# Altium schematic sheet Sheet2.SchDoc
size A4
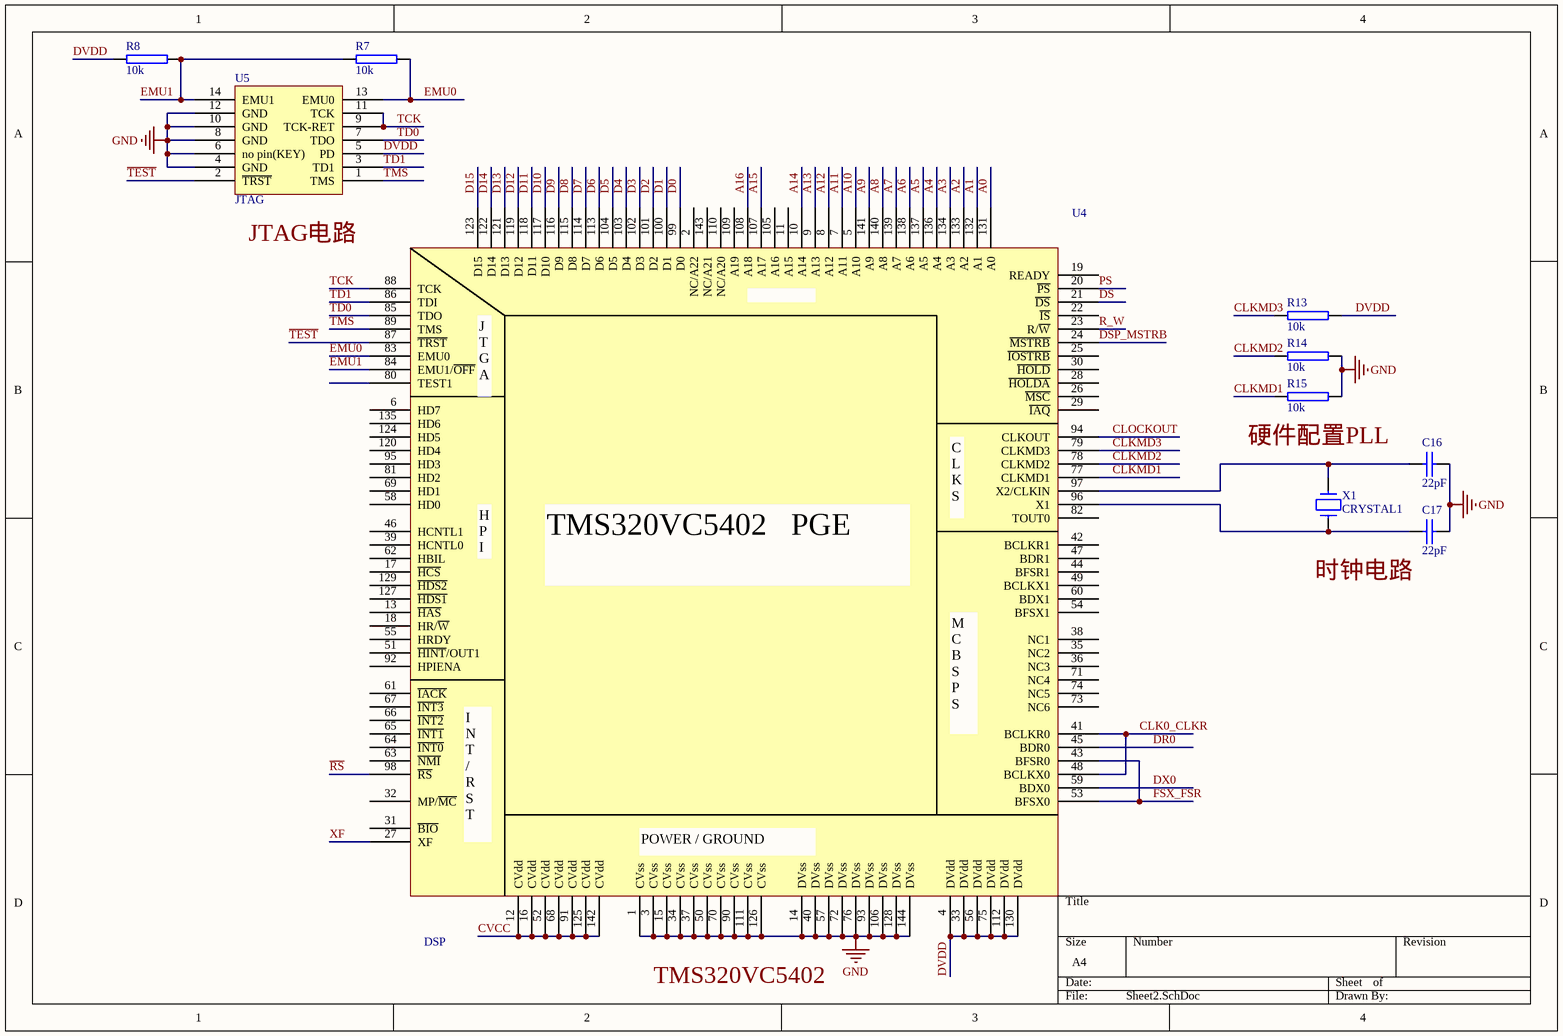
[diagram p0: Sheet2.SchDoc]

## Parts
C16  22pF  [C/5/4/2/R2]
C17  22pF  [C/5/4/2/R2]
R7  10k
R8  10k
R13  10k
R14  10k
R15  10k
U4  DSP
U5  JTAG
X1  CRYSTAL1  [X/2.5/2/6/2.5]

## Nets
GND: C16.2 C17.2 R14.1 R15.1 U4.1(CVss) U4.3(CVss) U4.14(DVss) U4.15(CVss) U4.34(CVss) U4.37(CVss) U4.40(DVss) U4.50(CVss) U4.57(DVss) U4.70(CVss) U4.72(DVss) U4.76(DVss) U4.90(CVss) U4.93(DVss) U4.106(DVss) U4.111(CVss) U4.126(CVss) U4.128(DVss) U4.144(DVss) U5.4(GND) U5.6(no_pin(KEY)) U5.8(GND) U5.10(GND) U5.12(GND)
A0: U4.131(A0)
A1: U4.132(A1)
A2: U4.133(A2)
A3: U4.134(A3)
A4: U4.136(A4)
A5: U4.137(A5)
A6: U4.138(A6)
A7: U4.139(A7)
A8: U4.140(A8)
A9: U4.141(A9)
A10: U4.5(A10)
A11: U4.7(A11)
A12: U4.8(A12)
A13: U4.9(A13)
A14: U4.10(A14)
A15: U4.107(A17)
A16: U4.108(A18)
CLK0_CLKR: U4.41(BCLKR0) U4.48(BCLKX0)
CLKMD1: R15.2 U4.77(CLKMD1)
CLKMD2: R14.2 U4.78(CLKMD2)
CLKMD3: R13.2 U4.79(CLKMD3)
CLOCKOUT: U4.94(CLKOUT)
CVCC: U4.12(CVdd) U4.16(CVdd) U4.52(CVdd) U4.68(CVdd) U4.91(CVdd) U4.125(CVdd) U4.142(CVdd)
D0: U4.99(D0)
D1: U4.100(D1)
D2: U4.101(D2)
D3: U4.102(D3)
D4: U4.103(D4)
D5: U4.104(D5)
D6: U4.113(D6)
D7: U4.114(D7)
D8: U4.115(D8)
D9: U4.116(D9)
D10: U4.117(D10)
D11: U4.118(D11)
D12: U4.119(D12)
D13: U4.121(D13)
D14: U4.122(D14)
D15: U4.123(D15)
DR0: U4.45(BDR0)
DS: U4.21(~{DS})
DSP_MSTRB: U4.24(~{MSTRB})
DVDD: R8.1 R13.1 U4.4(DVdd) U4.33(DVdd) U4.56(DVdd) U4.75(DVdd) U4.112(DVdd) U4.130(DVdd) U5.5(PD)
DX0: U4.59(BDX0)
EMU0: R7.1 U4.83(EMU0) U5.13(EMU0)
EMU1: R7.2 R8.2 U4.84(EMU1/~{OFF}) U5.14(EMU1)
FSX_FSR: U4.43(BFSR0) U4.53(BFSX0)
PS: U4.20(~{PS})
~{RS}: U4.98(~{RS})
R_W: U4.23(R/~{W})
~{TEST}: U4.87(~{TRST}) U5.2(~{TRST})
TCK: U4.88(TCK) U5.9(TCK-RET) U5.11(TCK)
TD0: U4.85(TDO) U5.7(TDO)
TD1: U4.86(TDI) U5.3(TD1)
TMS: U4.89(TMS) U5.1(TMS)
XF: U4.27(XF)
NetC16_1: C16.1 U4.97(X2/CLKIN) X1.1
NetC17_1: C17.1 U4.96(X1) X1.2

Not connected (* = marked no-connect by the designer): U4 2(NC/A22) 6(HD7) 11(A15) 13(~{HAS}) 17(~{HCS}) 18(HR/~{W}) 19(READY) 22(~{IS}) 25(~{IOSTRB}) 26(~{MSC}) 28(~{HOLDA}) 29(~{IAQ}) 30(~{HOLD}) 31(~{BIO}) 32(MP/~{MC}) 35(NC2) 36(NC3) 38(NC1) 39(HCNTL0) 42(BCLKR1) 44(BFSR1) 46(HCNTL1) 47(BDR1) 49(BCLKX1) 51(~{HINT}/OUT1) 54(BFSX1) 55(HRDY) 58(HD0) 60(BDX1) 61(~{IACK}) 62(HBIL) 63(~{NMI}) 64(~{INT0}) 65(~{INT1}) 66(~{INT2}) 67(~{INT3}) 69(HD1) 71(NC4) 73(NC6) 74(NC5) 80(TEST1) 81(HD2) 82(TOUT0) 92(HPIENA) 95(HD3) 105(A16) 109(A19) 110(NC/A20) 120(HD4) 124(HD5) 127(~{HDS1}) 129(~{HDS2}) 135(HD6) 143(NC/A21)

## Notes on the sheet
- Labels drawn without touching a wire or pin: JTAG电路, TMS320VC5402, 时钟电路, 硬件配置PLL
- (in symbol DSP) EMIF; J / T / G / A; C / L / K / S; H / P / I; TMS320VC5402   PGE; M / C / B / S / P / S; I / N / T / / / R / S / T; POWER / GROUND

## Library data of the parts
C16 C17 = CAP: Capacitor
R7 R8 R13-R15 = RES2
X1 = CRYSTAL1: Crystal